# Altium schematic sheet Serializer.SchDoc
size A
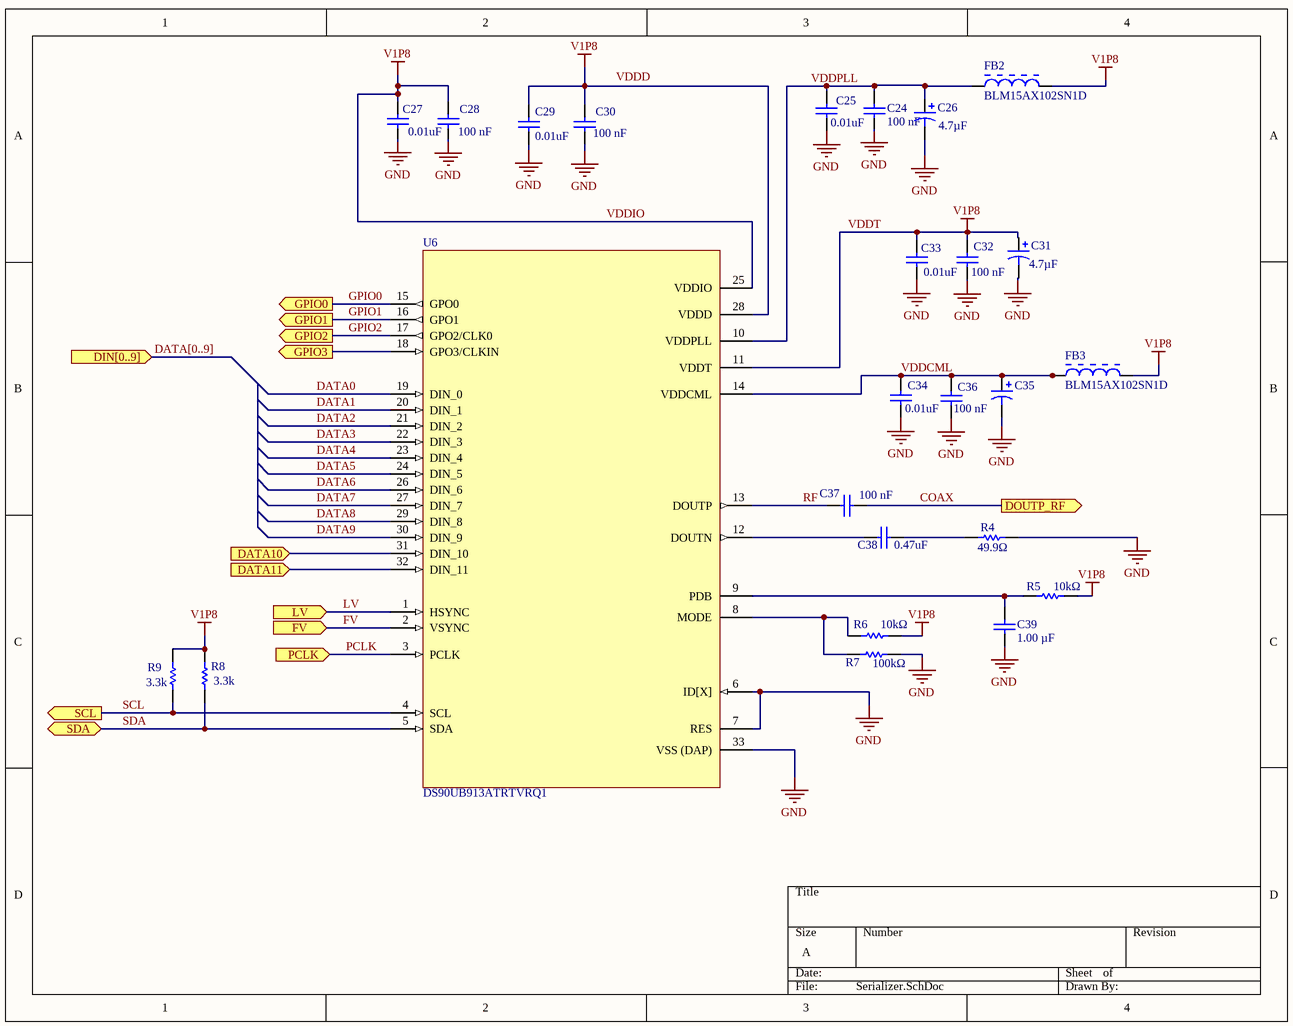
[diagram p0: Serializer.SchDoc]

## Parts
C24  Capacitance: 100 nF  [PCB-v6eq6etc9p7u7qdkgnno-1]  (hidden comment: GRM033C71C104KE14D)
C25  Capacitance: 0.01uF  [PCB-v6eq6etc9p7u7qdkgnno-1]  (hidden comment: GRM033R71A103KA01D)
C26  Capacitance: 4.7µF  [PCB-t0dwbiosd2m6unyihqym-1]  (hidden comment: F981A475MUALZT)
C27  Capacitance: 0.01uF  [PCB-v6eq6etc9p7u7qdkgnno-1]  (hidden comment: GRM033R71A103KA01D)
C28  Capacitance: 100 nF  [PCB-v6eq6etc9p7u7qdkgnno-1]  (hidden comment: GRM033C71C104KE14D)
C29  Capacitance: 0.01uF  [PCB-v6eq6etc9p7u7qdkgnno-1]  (hidden comment: GRM033R71A103KA01D)
C30  Capacitance: 100 nF  [PCB-v6eq6etc9p7u7qdkgnno-1]  (hidden comment: GRM033C71C104KE14D)
C31  Capacitance: 4.7µF  [PCB-t0dwbiosd2m6unyihqym-1]  (hidden comment: F981A475MUALZT)
C32  Capacitance: 100 nF  [PCB-v6eq6etc9p7u7qdkgnno-1]  (hidden comment: GRM033C71C104KE14D)
C33  Capacitance: 0.01uF  [PCB-v6eq6etc9p7u7qdkgnno-1]  (hidden comment: GRM033R71A103KA01D)
C34  Capacitance: 0.01uF  [PCB-v6eq6etc9p7u7qdkgnno-1]  (hidden comment: GRM033R71A103KA01D)
C35  F981A226MMALZT  [PCB-yxd74t6run51sg1ha7ug-1]  (value not drawn)
C36  Capacitance: 100 nF  [PCB-v6eq6etc9p7u7qdkgnno-1]  (hidden comment: GRM033C71C104KE14D)
C37  Capacitance: 100 nF  [PCB-v6eq6etc9p7u7qdkgnno-1]  (hidden comment: GRM033C71C104KE14D)
C38  Capacitance: 0.47uF  [PCB-v6eq6etc9p7u7qdkgnno-1]  (hidden comment: GRM033R60J473KE19D)
C39  Capacitance: 1.00 µF  [PCB-v6eq6etc9p7u7qdkgnno-1]  (hidden comment: GRM033R60J105MEA2D)
FB2  BLM15AX102SN1D  [MURA-BLM15-CHIP-2_V]
FB3  BLM15AX102SN1D  [MURA-BLM15-CHIP-2_V]
R4  Resistance: 49.9Ω  [PCB-7g93mzch2qc2q3jid3ok-1]  (hidden comment: TNPW020149R9BEED)
R5  Resistance: 10kΩ  [PCB-7g93mzch2qc2q3jid3ok-1]  (hidden comment: ERJ-1GNF1002C)
R6  Resistance: 10kΩ  [PCB-7g93mzch2qc2q3jid3ok-1]  (hidden comment: ERJ-1GNF1002C)
R7  Resistance: 100kΩ  [PCB-7g93mzch2qc2q3jid3ok-1]  (hidden comment: ERJ-1GNF1003C)
R8  Resistance: 3.3k  [PCB-7g93mzch2qc2q3jid3ok-1]  (hidden comment: ERJ-1GNF3301C)
R9  Resistance: 3.3k  [PCB-7g93mzch2qc2q3jid3ok-1]  (hidden comment: ERJ-1GNF3301C)
U6  DS90UB913ATRTVRQ1  [PCB-l2nnig1h4ckv44w98gav-1]

## Ports
DATA10 (in), DATA11 (in), DIN[0..9] (in), DOUTP_RF (out), FV (in), GPIO0 (out), GPIO1 (out), GPIO2 (out), GPIO3 (out), LV (in), PCLK (in), SCL (out), SDA (bidir)

## Nets
GND: C24.1 C25.1 C26.2 C27.1 C28.1 C29.1 C30.1 C31.2 C32.1 C33.1 C34.1 C35.2 C36.1 C39.1 R4.2 R7.2 U6.6(ID[X]) U6.7(RES) U6.33(VSS_(DAP))
VDDIO: C27.2 C28.2 C29.2 C30.2 C31.1 C32.2 C33.2 FB2.2 FB3.2 R5.2 R6.2 R8.2 R9.2 U6.11(VDDT) U6.25(VDDIO) U6.28(VDDD)  [also labelled V1P8, VDDT]
COAX: C37.1 ; port DOUTP_RF
DATA0: U6.19(DIN_0)
DATA1: U6.20(DIN_1)
DATA2: U6.21(DIN_2)
DATA3: U6.22(DIN_3)
DATA4: U6.23(DIN_4)
DATA5: U6.24(DIN_5)
DATA6: U6.26(DIN_6)
DATA7: U6.27(DIN_7)
DATA8: U6.29(DIN_8)
DATA9: U6.30(DIN_9)
DATA10: U6.31(DIN_10) ; port DATA10
DATA11: U6.32(DIN_11) ; port DATA11
FV: U6.2(VSYNC) ; port FV
GPIO0: U6.15(GPO0) ; port GPIO0
GPIO1: U6.16(GPO1) ; port GPIO1
GPIO2: U6.17(GPO2/CLK0) ; port GPIO2
GPIO3: U6.18(GPO3/CLKIN) ; port GPIO3
LV: U6.1(HSYNC) ; port LV
PCLK: U6.3(PCLK) ; port PCLK
RF: C37.2 U6.13(DOUTP)
SCL: R9.1 U6.4(SCL) ; port SCL
SDA: R8.1 U6.5(SDA) ; port SDA
VDDCML: C34.2 C35.1 C36.2 FB3.1 U6.14(VDDCML)
VDDPLL: C24.2 C25.2 C26.1 FB2.1 U6.10(VDDPLL)
NetC38_1: C38.1 U6.12(DOUTN)
NetC38_2: C38.2 R4.1
NetC39_2: C39.2 R5.1 U6.9(PDB)
NetR6_1: R6.1 R7.1 U6.8(MODE)

## Buses and harness runs
bus DATA[0..9] = port DIN[0..9]

## Notes on the sheet
- Labels drawn without touching a wire or pin: VDDD

## Library data of the parts
C24 C28 C30 C32 C36 C37 = CMP-cc290632c88a13ee-3: 0.1 µF ±10% 16V Ceramic Capacitor X7S 0201 (0603 Metric); Lead-Free Status: Lead Free; Voltage Rating (DC): 16.0 V; Packaging: Reel; Dielectric Characteristic: X7S; OctopartID: cc290632c88a13ee; Size-Width: 300 µm; Manufacturer Part Number: GRM033C71C104KE14D; Case/Package: 0201; Capacitance Tolerance: ±10%; Size-Length: 600 µm; Octopart URL: http://octopart.com/grm033c71c104ke14d-murata-51454405; Mounting Style: Surface Mount; Size-Thickness: 300 µm; RoHS: Compliant
C25 C27 C29 C33 C34 = CMP-19299660-4: 10000 pF ±10% 10V Ceramic Capacitor X7R 0201 (0603 Metric); Case/Package: 0201
C26 C31 = CMP-b7737c8c1b6d68b4-6: 4.7 µF Molded Tantalum Capacitors 10 V 0402 (1005 Metric) -; Voltage - Rated: 10V; OctopartID: b7737c8c1b6d68b4; Octopart URL: http://octopart.com/f981a475mualzt-avx-49645944; Packaging: Tape & Reel (TR)
C35 = CMP-ed552659f9643292-2: 22 µF Molded Tantalum Capacitors 10 V 0603 (1608 Metric) 8Ohm @ 100kHz; Capacitance: 22µF; Voltage Rating: 10Vdc; Octopart URL: http://octopart.com/f981a226mmalzt-avx-33960279; Manufacturer Part Number: F981A226MMALZT; Packaging: Reel; Case/Package: 0603
C38 = CMP-131779-4: 0.047 µF ±10% 6.3V Ceramic Capacitor X5R 0201 (0603 Metric); Case/Package (SI): 0603; Capacitance Tolerance: ±10%; Dielectric Characteristic: X5R; RoHS: Compliant; Size-Length: 0.0006 m; Size-Width: 0.0003 m; Voltage Rating (DC): 6.3 V
C39 = CMP-7dcab586fd61a20d-5: 1 µF ±20% 6.3V Ceramic Capacitor X5R 0201 (0603 Metric); Case/Package (SI): 0603; Dielectric Characteristic: X5R; Size-Length: 600 µm; OctopartID: 7dcab586fd61a20d
FB2 FB3 = CMP-886590-4: 1 kOhms @ 100 MHz 1 - Ferrite Bead 0402 (1005 Metric) 350mA 490mOhm; Lead-Free Status: Lead Free; Number of Circuits: 1; Resistance: 1000.0 Ω; Octopart Url: https://octopart.com/blm15ax102sn1d-murata-17749155; OctopartID: 6cdea4da9d1bb319; REACH SVHC Compliance: No SVHC; RoHS: Compliant; Size-Length: 0.001 m; Size-Width: 0.0005 m
R4 = CMP-1848375-4: 49.9 Ohms ±0.1% 0.05W, 1/20W Chip Resistor 0201 (0603 Metric) Anti-Sulfur, Automotive AEC-Q200, Moisture Resistant Thin Film; Packaging: Cut Tape (CT); Power Rating: 0.05 W
R5 R6 = CMP-1848298-4: 10 kOhms ±1% 0.05W, 1/20W Chip Resistor 0201 (0603 Metric) Automotive AEC-Q200 Thick Film; Lead-Free Status: Lead Free; Resistance Tolerance: ±5%; Voltage Rating (DC): 25.0 V; Case/Package: 0201; Lifecycle Status: Not Listed by Manufacturer; Mounting Style: Surface Mount; Octopart Url: https://octopart.com/erj-1gej103c-panasonic-39841918; Power Rating: 0.05 W; RoHS: Compliant; Size-Height: 0.00023 m; Size-Length: 0.0006 m; Size-Width: 0.0003 m
R7 = CMP-1848300-4: 100 kOhms ±1% 0.05W, 1/20W Chip Resistor 0201 (0603 Metric) Automotive AEC-Q200 Thick Film; Lifecycle Status: Not Listed by Manufacturer; Octopart Url: https://octopart.com/erj-1gej104c-panasonic-55411467; Size-Height: 0.00023 m; Size-Width: 0.0003 m
R8 R9 = CMP-1848326-4: 3.3 kOhms ±1% 0.05W, 1/20W Chip Resistor 0201 (0603 Metric) Automotive AEC-Q200 Thick Film; Resistance Tolerance: ±5%; Size-Height: 0.00023 m
U6 = CMP-1f96d75fdae3c051-6: 1.4Gbps Serializer 12 Input 1 Output 32-WQFN (5x5); Octopart URL: http://octopart.com/ds90ub913atrtvrq1-texas+instruments-29614099; Packaging: Reel; RoHS: Compliant; Case/Package: WQFN; Number of Pins: 32